# Altium project DistanceSensor.PrjPcb
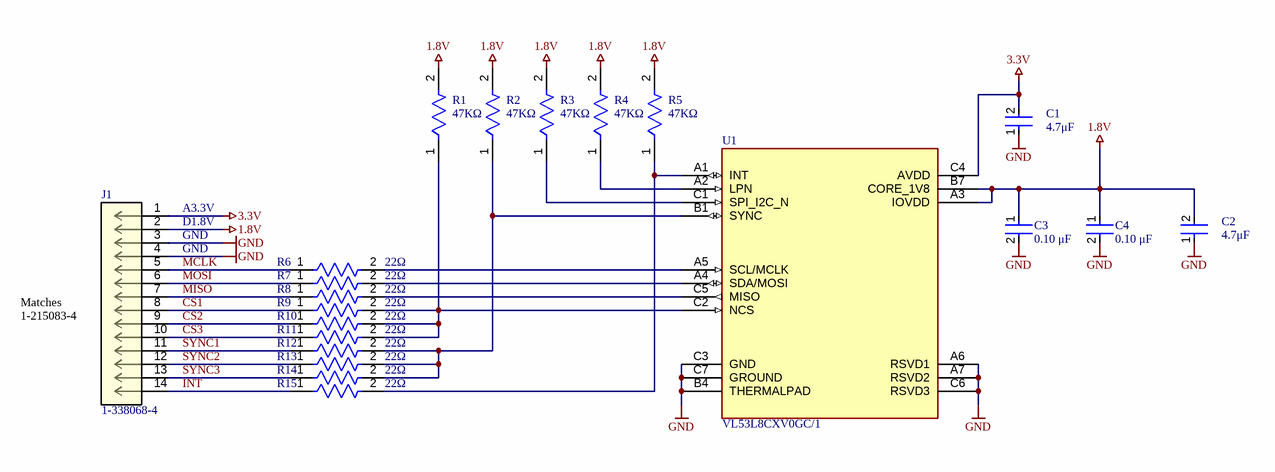
[diagram p0: DistanceSensor.SchDoc]
seAuthor: Stefan Lüthi; seProject: robby; seRevision: 1.0
1 sheet, 21 parts. Net scope: global (net labels, ports and power ports of the same name join across sheets).
Board file: DistanceSensor.PcbDoc

## Sheet DistanceSensor.SchDoc
size A4; SheetNumber: 1; SheetTotal: 1

### Parts
C1  Parameter 1: 4.7μF  [FP-GRM188-0_15-IPC_B]  (hidden comment: GRM188Z71A475ME15D)
C2  Parameter 1: 4.7μF  [FP-GRM188-0_15-IPC_B]  (hidden comment: GRM188Z71A475ME15D)
C3  value 0.10 μF  [FP-C0603C-CF-MFG]  (hidden comment: C0603C104M5RACTU)
C4  value 0.10 μF  [FP-C0603C-CF-MFG]  (hidden comment: C0603C104M5RACTU)
J1  1-338068-4  [CONN_1-338068-4_TYC]
R1  value 47KΩ  [FP-RT0603-MFG]  (hidden comment: RT0603FRE0747KL)
R2  value 47KΩ  [FP-RT0603-MFG]  (hidden comment: RT0603FRE0747KL)
R3  value 47KΩ  [FP-RT0603-MFG]  (hidden comment: RT0603FRE0747KL)
R4  value 47KΩ  [FP-RT0603-MFG]  (hidden comment: RT0603FRE0747KL)
R5  value 47KΩ  [FP-RT0603-MFG]  (hidden comment: RT0603FRE0747KL)
R6  value 22Ω  [FP-RT0603-MFG]  (hidden comment: RT0603FRE0722RL)
R7  value 22Ω  [FP-RT0603-MFG]  (hidden comment: RT0603FRE0722RL)
R8  value 22Ω  [FP-RT0603-MFG]  (hidden comment: RT0603FRE0722RL)
R9  value 22Ω  [FP-RT0603-MFG]  (hidden comment: RT0603FRE0722RL)
R10  value 22Ω  [FP-RT0603-MFG]  (hidden comment: RT0603FRE0722RL)
R11  value 22Ω  [FP-RT0603-MFG]  (hidden comment: RT0603FRE0722RL)
R12  value 22Ω  [FP-RT0603-MFG]  (hidden comment: RT0603FRE0722RL)
R13  value 22Ω  [FP-RT0603-MFG]  (hidden comment: RT0603FRE0722RL)
R14  value 22Ω  [FP-RT0603-MFG]  (hidden comment: RT0603FRE0722RL)
R15  value 22Ω  [FP-RT0603-MFG]  (hidden comment: RT0603FRE0722RL)
U1  VL53L8CXV0GC/1  [IC17_LGA16_STM]

### Nets
1.8V: C2.2 C3.1 C4.1 J1.2 R1.2 R2.2 R3.2 R4.2 R5.2 U1.A3(IOVDD) U1.B7(CORE_1V8)
3.3V: C1.2 J1.1 U1.C4(AVDD)
GND: C1.1 C2.1 C3.2 C4.2 J1.3 J1.4 U1.A6(RSVD1) U1.A7(RSVD2) U1.B4(THERMALPAD) U1.C3(GND) U1.C6(RSVD3) U1.C7(GROUND)
CS1: J1.8 R9.1
CS2: J1.9 R10.1
CS3: J1.10 R11.1
~{INT}: J1.14 R15.1
MCLK: J1.5 R6.1
MISO: J1.7 R8.1
MOSI: J1.6 R7.1
SYNC1: J1.11 R12.1
SYNC2: J1.12 R13.1
SYNC3: J1.13 R14.1
NetR1_1: R1.1 R9.2 R10.2 R11.2 U1.C2(NCS)
NetR2_1: R2.1 R12.2 R13.2 R14.2 U1.B1(SYNC)
NetR3_1: R3.1 U1.C1(SPI_I2C_N)
NetR4_1: R4.1 U1.A2(LPN)
NetR5_1: R5.1 R15.2 U1.A1(INT)
NetR6_2: R6.2 U1.A5(SCL/MCLK)
NetR7_2: R7.2 U1.A4(SDA/MOSI)
NetR8_2: R8.2 U1.C5(MISO)

### Notes on the sheet
- (near J1) A3.3V
- (near J1) D1.8V
- (near J1) GND
- (near J1) Matches 1-215083-4
- Project:
- Board:
- Title:
- Size:
- Sheet:
- A4
- of
- Drawn by:
- Revision:
- Date:
- Variant:
- Source Engineers GmbH | CH-3012 Bern
- File:

### Library data of the parts
C1 C2 = CMP-06035-024346-1: Chip Multilayer Ceramic Capacitors for General Purpose, 0603, 4.7uF, X7R, 15%, 20%, 10V; Case/Package: 0603
C3 C4 = CMP-2006-03068-2: CAP CER 0.1UF 50V 20% X7R 0603; Manufacturer: KEMET; Material: Ceramic; Tolerance: 0.2; Temperature Coefficient: 30ppm/°C; Automotive Grade: Grade 1; Temperature Range High: +125°C; Voltage Rating: 50 V; Device Class L3: Ceramic Capacitors; Manufacturer Part Number: C0603C104M5RACTU; Height: 0.87mm; Category: Cap; RoHS: TRUE; Digikey Description: CAP CER 0.1UF 50V 20% X7R 0603; ComponentLink2URL: https://api.kemet.com/component-edge/download/datasheet/C0603C100J5GACAUTO.pdf; Lead Free: Yes; Temperature Range Low: -55°C; Device Class L1: Passive Components; ComponentLink2Description: Datasheet; Temperature Characteristic: X7R; Automotive: Yes; Temperature: -55°C to +125°C; Octopart: https://octopart.com/c0603c104m5ractu-kemet-11855687; Device Class L2: Capacitors; Package: C0603C-CF; Mouser Description: Multilayer Ceramic Capacitors MLCC - SMD/SMT 50volts 0.1uF X7R 20%; Capacitance: 0.10 μF
J1 = 1-338068-4: MICRO-MATCH FTE,14P; Manufacturer_Name: TE Connectivity; Copyright: Copyright (C) 2025 Ultra Librarian. All rights reserved.; Manufacturer_Part_Number: 1-338068-4; Datasheet: https://www.te.com/commerce/DocumentDelivery/DDEController?Action=srchrtrv&DocNm=4-1773457-1_050_Micro_MaTch&DocType=Data+Sheet&DocLang=English&PartCntxt=1-338068-4&DocFormat=pdf; RefDes: RefDes; Type: Type; Supplier 1: DigiKey; Supplier Part Number 1: A99502CT-ND; Supplier 2: DigiKey; Supplier Part Number 2: A99502TR-ND; Supplier 3: Mouser; Supplier Part Number 3: 571-1-338068-4
R1-R5 = CMP-03412-008772-1: RES 47.0K OHM 1/10W 1% SMD 0603; Manufacturer: Yageo; Tolerance: 0.01; Power Rating: 0.1W; Voltage Rating: 75V; Temperature Coefficient: 50 ppm/°C; RoHS: TRUE; Temperature: -55°C to +155°C; Package: RT0603; Lead Free: Yes; Height: 0.55mm; Composition: Thin Film; Octopart: https://octopart.com/rt0603fre0747kl-yageo-40011881; Automotive: No; Device Class L1: Passive Components; Device Class L2: Resistors; Manufacturer Part Number: RT0603FRE0747KL; Mouser Description: High Precision-High Stability Chip Resistor Thin Film 0603 47kOhm 1% Paper T/R; Footprint Url: http://www.yageo.com/exep/pages/download/literatures/PYu-R_Mount_10.pdf; Category: Res; Temperature Range Low: -55°C; ComponentLink2URL: http://www.yageo.com/documents/recent/PYu-RT_1-to-0.01_RoHS_L_9.pdf; Series: RT; Resistance: 47KΩ; Ipc Land Pattern Name: RESC16080X45; ComponentLink2Description: Datasheet; Digikey Description: RES 47.0K OHM 1/10W 1% SMD 0603; Device Class L3: Chip SMD Resistors; Temperature Range High: +155°C
R6-R15 = CMP-03412-023299-1: RES SMD 22 OHM 1% 1/10W 0603; Manufacturer: Yageo; Temperature Coefficient: 50 ppm/°C; Tolerance: 0.01; Power Rating: 0.1W; Voltage Rating: 75V; ComponentLink2Description: Datasheet; Device Class L2: Resistors; Device Class L1: Passive Components; ComponentLink2URL: http://www.yageo.com/documents/recent/PYu-RT_1-to-0.01_RoHS_L_9.pdf; Lead Free: Yes; Temperature Range Low: -55°C; Manufacturer Part Number: RT0603FRE0722RL; Height: 0.55mm; Package: RT0603; Footprint Url: http://www.yageo.com/exep/pages/download/literatures/PYu-R_Mount_10.pdf; Octopart: https://octopart.com/rt0603fre0722rl-yageo-39814074; Category: Res; Ipc Land Pattern Name: RESC16080X45; Digikey Description: RES SMD 22 OHM 1% 1/10W 0603; Mouser Description: High Precision-High Stability Chip Resistor Thin Film 0603 22Ohm 1% Paper T/R; Automotive: No; Temperature Range High: +155°C; Device Class L3: Chip SMD Resistors; RoHS: TRUE; Series: RT; Resistance: 22Ω; Temperature: -55°C to +155°C; Composition: Thin Film
U1 = VL53L8CXV0GC1: Low-power high-performance 8x8 multizone Time-of-Flight sensor (ToF); Manufacturer_Name: STMicroelectronics; Copyright: Copyright (C) 2025 Ultra Librarian. All rights reserved.; Manufacturer_Part_Number: VL53L8CXV0GC/1; RefDes: RefDes; Type: Type; Supplier 1: Farnell; Supplier Part Number 1: 4168721; Supplier 2: Farnell; Supplier Part Number 2: 4168721RL; Supplier 3: DigiKey; Supplier Part Number 3: 497-VL53L8CXV0GC/1CT-ND; Supplier 4: DigiKey; Supplier Part Number 4: 497-VL53L8CXV0GC/1DKR-ND; Supplier 5: DigiKey; Supplier Part Number 5: 497-VL53L8CXV0GC/1TR-ND; Supplier 6: Mouser; Supplier Part Number 6: 511-VL53L8CXV0GC/1

## Assembly variants
Sensor1: not fitted R10 R11 R13 R14